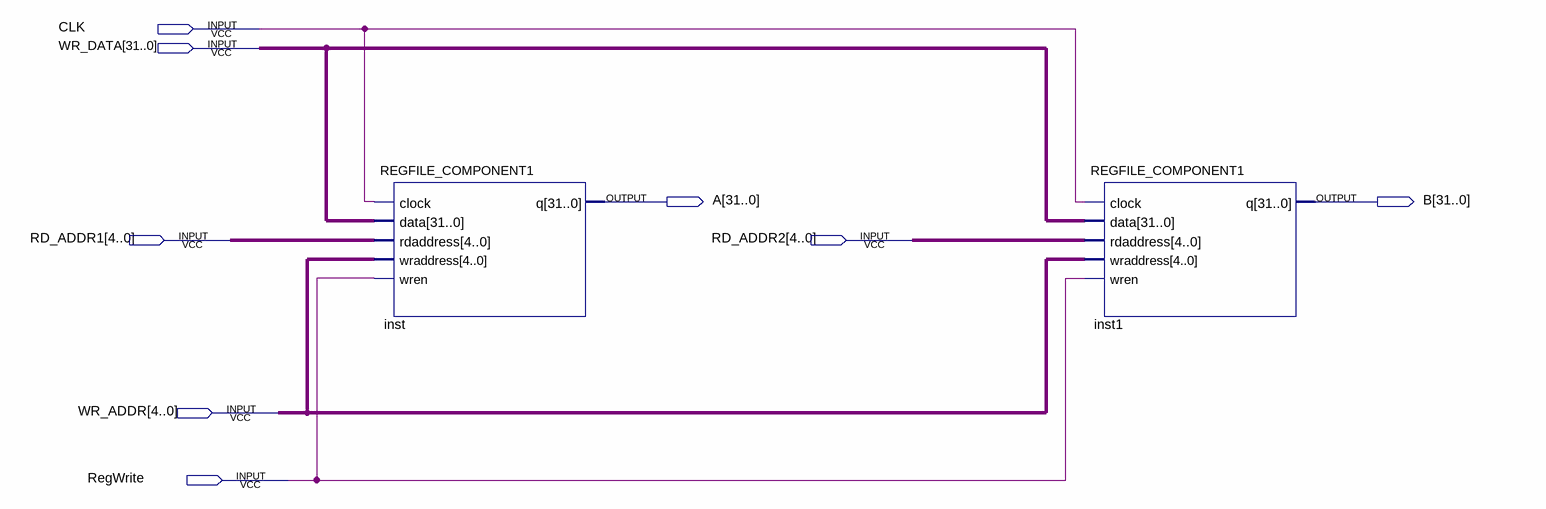
[diagram p0: schematic sheet]
// Quartus schematic REGISTER_FILE.bdf as structural Verilog: 2 symbols, 8 pins
module REGISTER_FILE (
  input  CLK,
  input  [31:0] WR_DATA,
  input  [4:0] RD_ADDR1,
  input  [4:0] RD_ADDR2,
  input  [4:0] WR_ADDR,
  input  RegWrite,
  output [31:0] A,
  output [31:0] B
);

  REGFILE_COMPONENT1 inst (
    .clock(CLK), .data(WR_DATA), .rdaddress(RD_ADDR1), .wraddress(WR_ADDR), .wren(RegWrite), .q(A));
  REGFILE_COMPONENT1 inst1 (
    .clock(CLK), .data(WR_DATA), .rdaddress(RD_ADDR2), .wraddress(WR_ADDR), .wren(RegWrite), .q(B));
endmodule
